# EAGLE schematic flip flop pcb 1.0 (EAGLE 6.5.0)
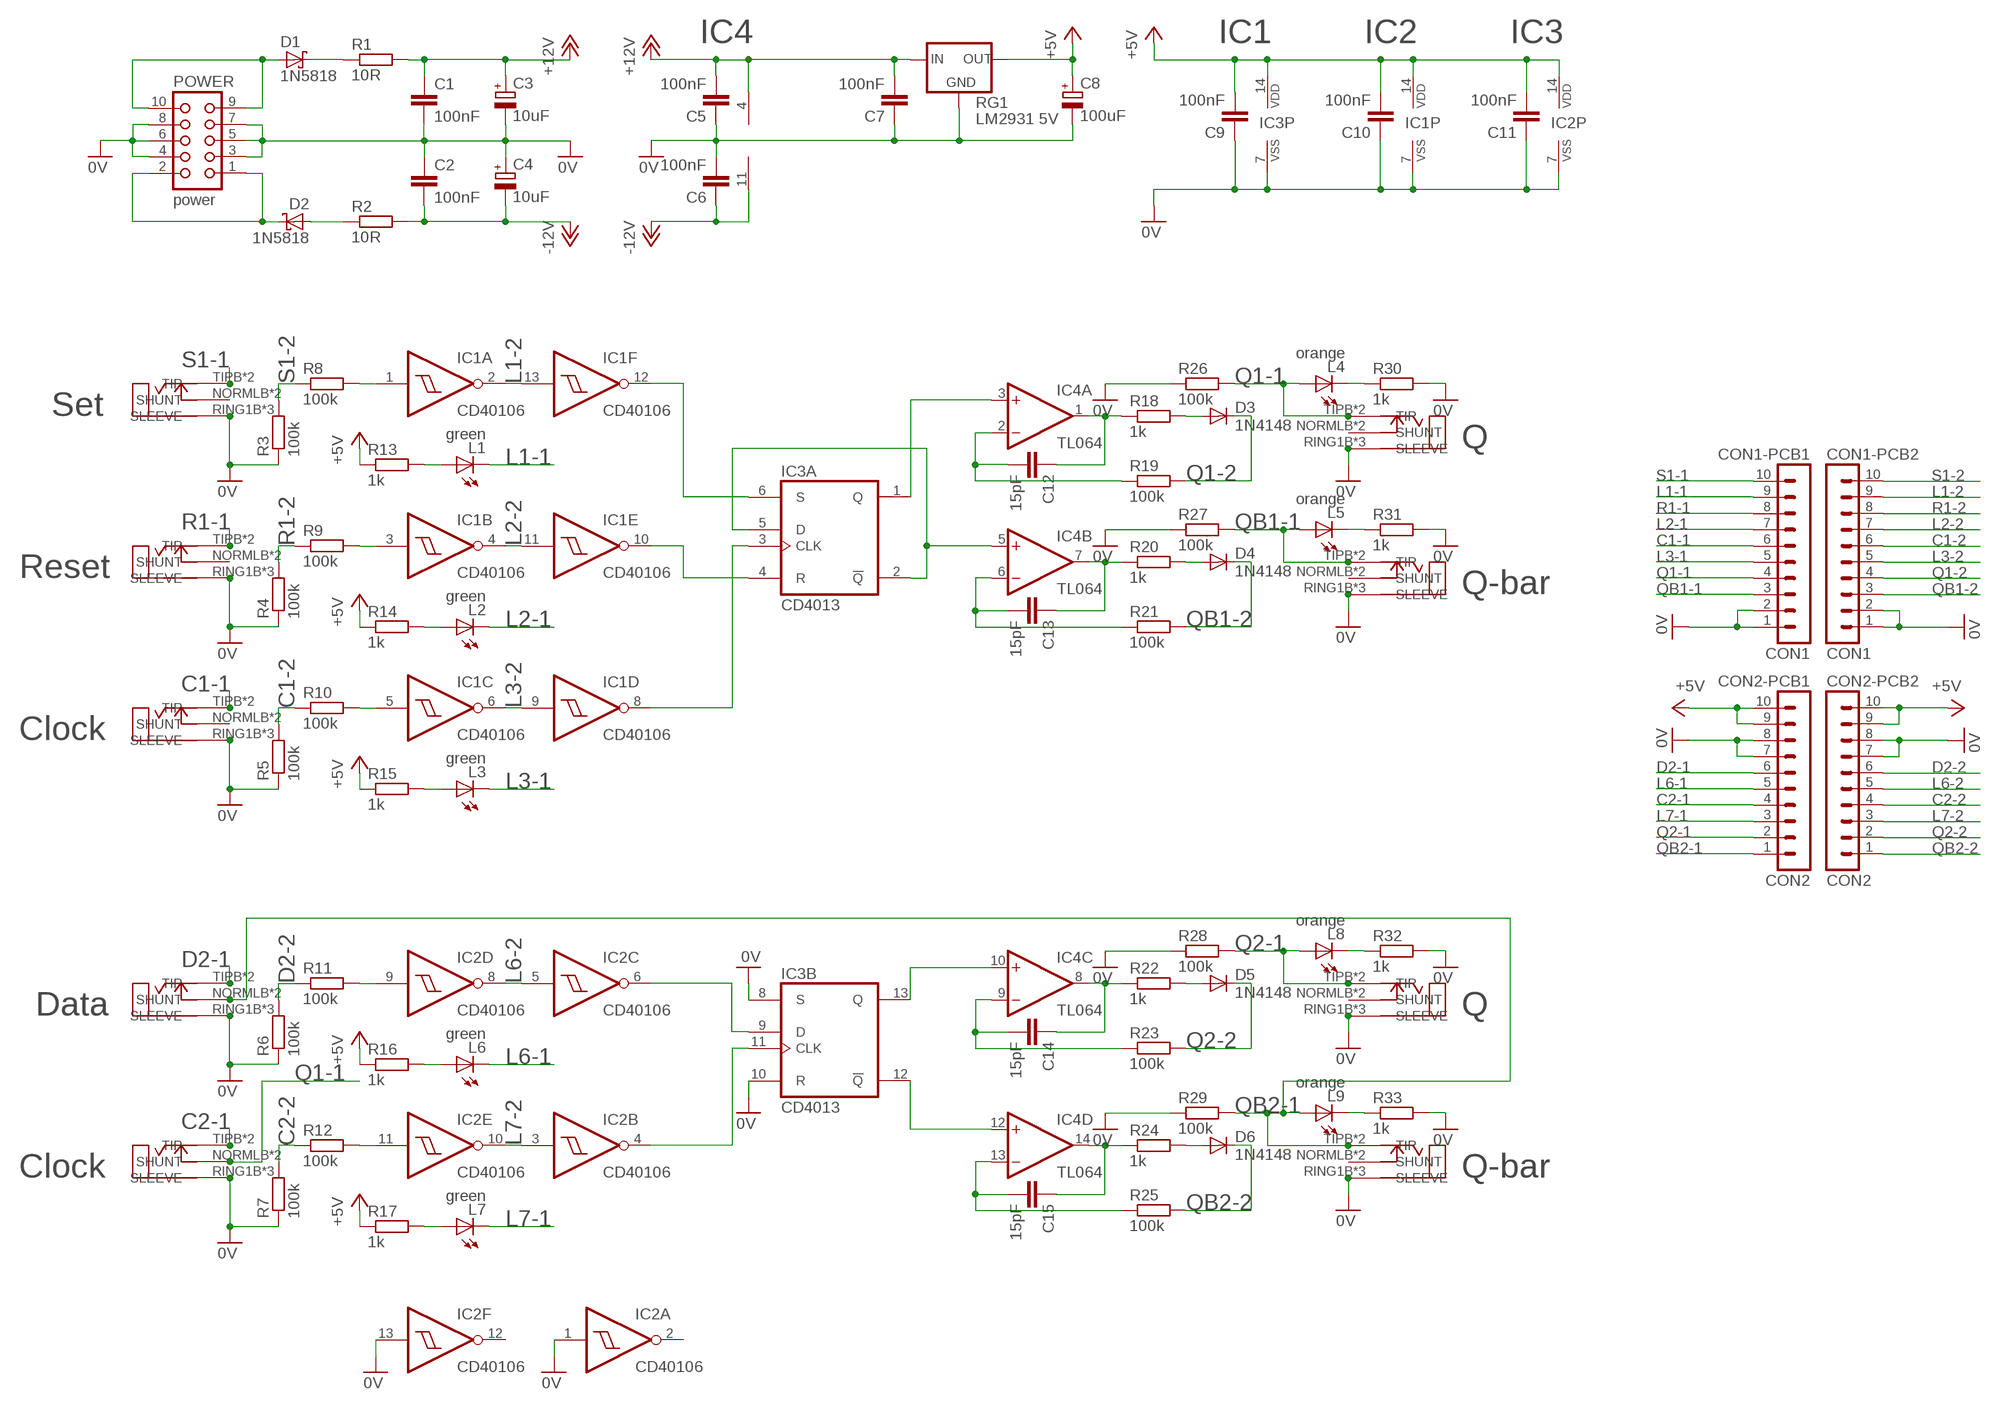
[diagram p0: schematic, sheet 1]

## Parts
C1  100nF  C-EU025-024X044  [C025-024X044]
C2  100nF  C-EU025-024X044  [C025-024X044]
C3  10uF  CPOL-EUE2-5  [E2-5]
C4  10uF  CPOL-EUE2-5  [E2-5]
C5  100nF  C-EU025-024X044  [C025-024X044]
C6  100nF  C-EU025-024X044  [C025-024X044]
C7  100nF  C-EU025-024X044  [C025-024X044]
C8  100uF  CPOL-EUE2.5-6  [E2,5-6]
C9  100nF  C-EU025-024X044  [C025-024X044]
C10  100nF  C-EU025-024X044  [C025-024X044]
C11  100nF  C-EU025-024X044  [C025-024X044]
C12  15pF  C-EU025-024X044  [C025-024X044]
C13  15pF  C-EU025-024X044  [C025-024X044]
C14  15pF  C-EU025-024X044  [C025-024X044]
C15  15pF  C-EU025-024X044  [C025-024X044]
CON1-PCB1  CON1  MA10-1  [MA10-1]
CON1-PCB2  CON1  MA10-1  [MA10-1]
CON2-PCB1  CON2  MA10-1  [MA10-1]
CON2-PCB2  CON2  MA10-1  [MA10-1]
D1  1N5818  SB130DO-204AL  [DO41-7]
D2  1N5818  SB130DO-204AL  [DO41-7]
D3  1N4148  1N4148DO35-7  [DO35-7]
D4  1N4148  1N4148DO35-7  [DO35-7]
D5  1N4148  1N4148DO35-7  [DO35-7]
D6  1N4148  1N4148DO35-7  [DO35-7]
IC1  CD40106  40106N  [DIL14]
IC2  CD40106  40106N  [DIL14]
IC3  CD4013  4013N  [DIL14]
IC4  TL064  TL074P  [DIL14]
J1  ERTHENVAR_3.5MM_JACKSLOTS  [ERTHENVAR-SLOTS]
J2  ERTHENVAR_3.5MM_JACKSLOTS  [ERTHENVAR-SLOTS]
J3  ERTHENVAR_3.5MM_JACKSLOTS  [ERTHENVAR-SLOTS]
J4  ERTHENVAR_3.5MM_JACKSLOTS  [ERTHENVAR-SLOTS]
J5  ERTHENVAR_3.5MM_JACKSLOTS  [ERTHENVAR-SLOTS]
J6  ERTHENVAR_3.5MM_JACKSLOTS  [ERTHENVAR-SLOTS]
J7  ERTHENVAR_3.5MM_JACKSLOTS  [ERTHENVAR-SLOTS]
J8  ERTHENVAR_3.5MM_JACKSLOTS  [ERTHENVAR-SLOTS]
J9  ERTHENVAR_3.5MM_JACKSLOTS  [ERTHENVAR-SLOTS]
L1  green  LED3MM  [LED3MM]
L2  green  LED3MM  [LED3MM]
L3  green  LED3MM  [LED3MM]
L4  orange  LED3MM  [LED3MM]
L5  orange  LED3MM  [LED3MM]
L6  green  LED3MM  [LED3MM]
L7  green  LED3MM  [LED3MM]
L8  orange  LED3MM  [LED3MM]
L9  orange  LED3MM  [LED3MM]
POWER  power  CON10L  [CON10L]
R1  10R  R-EU_0207/10  [0207/9]
R2  10R  R-EU_0207/10  [0207/9]
R3  100k  R-EU_0207/10  [0207/9]
R4  100k  R-EU_0207/10  [0207/9]
R5  100k  R-EU_0207/10  [0207/9]
R6  100k  R-EU_0207/10  [0207/9]
R7  100k  R-EU_0207/10  [0207/9]
R8  100k  R-EU_0207/10  [0207/9]
R9  100k  R-EU_0207/10  [0207/9]
R10  100k  R-EU_0207/10  [0207/9]
R11  100k  R-EU_0207/10  [0207/9]
R12  100k  R-EU_0207/10  [0207/9]
R13  1k  R-EU_0204/5  [0204/5]
R14  1k  R-EU_0204/5  [0204/5]
R15  1k  R-EU_0204/5  [0204/5]
R16  1k  R-EU_0204/5  [0204/5]
R17  1k  R-EU_0204/5  [0204/5]
R18  1k  R-EU_0207/10  [0207/9]
R19  100k  R-EU_0207/10  [0207/9]
R20  1k  R-EU_0207/10  [0207/9]
R21  100k  R-EU_0207/10  [0207/9]
R22  1k  R-EU_0207/10  [0207/9]
R23  100k  R-EU_0207/10  [0207/9]
R24  1k  R-EU_0207/10  [0207/9]
R25  100k  R-EU_0207/10  [0207/9]
R26  100k  R-EU_0204/5  [0204/5]
R27  100k  R-EU_0204/5  [0204/5]
R28  100k  R-EU_0204/5  [0204/5]
R29  100k  R-EU_0204/5  [0204/5]
R30  1k  R-EU_0204/5  [0204/5]
R31  1k  R-EU_0204/5  [0204/5]
R32  1k  R-EU_0204/5  [0204/5]
R33  1k  R-EU_0204/5  [0204/5]
RG1  LM2931 5V  78LXXLM2931XXX  [TO92-LINE]

## Nets
0V: C1.2 C2.1 C3.- C4.+ C5.1 C6.2 C7.1 C8.- C9.1 C10.1 C11.1 CON1-PCB1.1 CON1-PCB1.2 CON1-PCB2.1 CON1-PCB2.2 CON2-PCB1.7 CON2-PCB1.8 CON2-PCB2.7 CON2-PCB2.8 IC1.7(P:VSS) IC2.1(A:I) IC2.7(P:VSS) IC2.13(F:I) IC3.7(P:VSS) IC3.8(B:S) IC3.10(B:R) J1.RING1B(SLEEVE) J1.RING1T(SLEEVE) J1.RING2H(SLEEVE) J2.RING1B(SLEEVE) J2.RING1T(SLEEVE) J2.RING2H(SLEEVE) J3.RING1B(SLEEVE) J3.RING1T(SLEEVE) J3.RING2H(SLEEVE) J4.RING1B(SLEEVE) J4.RING1T(SLEEVE) J4.RING2H(SLEEVE) J5.RING1B(SLEEVE) J5.RING1T(SLEEVE) J5.RING2H(SLEEVE) J6.RING1B(SLEEVE) J6.RING1T(SLEEVE) J6.RING2H(SLEEVE) J7.RING1B(SLEEVE) J7.RING1T(SLEEVE) J7.RING2H(SLEEVE) J8.RING1B(SLEEVE) J8.RING1T(SLEEVE) J8.RING2H(SLEEVE) J9.RING1B(SLEEVE) J9.RING1T(SLEEVE) J9.RING2H(SLEEVE) POWER.3 POWER.4 POWER.5 POWER.6 POWER.7 POWER.8 R3.1 R4.1 R5.1 R6.1 R7.1 R26.1 R27.1 R28.1 R29.1 R30.2 R31.2 R32.2 R33.2 RG1.2(GND)
+5V: C8.+ C9.2 C10.2 C11.2 CON2-PCB1.9 CON2-PCB1.10 CON2-PCB2.9 CON2-PCB2.10 IC1.14(P:VDD) IC2.14(P:VDD) IC3.14(P:VDD) R13.1 R14.1 R15.1 R16.1 R17.1 RG1.3(OUT)
+12V: C1.1 C3.+ C5.2 C7.2 IC4.4(P:V+) R1.2 RG1.1(IN)
-12V: C2.2 C4.- C6.1 IC4.11(P:V-) R2.2
C1-1: CON1-PCB1.6 J3.TIPB(TIP) J3.TIPT(TIP)
C1-2: CON1-PCB2.6 R5.2 R10.1
C2-1: CON2-PCB1.4 J5.TIPB(TIP) J5.TIPT(TIP)
C2-2: CON2-PCB2.4 R7.2 R12.1
D2-1: CON2-PCB1.6 J4.TIPB(TIP) J4.TIPT(TIP)
D2-2: CON2-PCB2.6 R6.2 R11.1
L1-1: CON1-PCB1.9 L1.K(C)
L1-2: CON1-PCB2.9 IC1.2(A:O) IC1.13(F:I)
L2-1: CON1-PCB1.7 L2.K(C)
L2-2: CON1-PCB2.7 IC1.4(B:O) IC1.11(E:I)
L3-1: CON1-PCB1.5 L3.K(C)
L3-2: CON1-PCB2.5 IC1.6(C:O) IC1.9(D:I)
L6-1: CON2-PCB1.5 L6.K(C)
L6-2: CON2-PCB2.5 IC2.5(C:I) IC2.8(D:O)
L7-1: CON2-PCB1.3 L7.K(C)
L7-2: CON2-PCB2.3 IC2.3(B:I) IC2.10(E:O)
N$2: IC1.1(A:I) R8.2
N$3: IC3.2(A:!Q) IC3.5(A:D) IC4.5(B:+IN)
N$4: IC1.3(B:I) R9.2
N$5: IC1.5(C:I) R10.2
N$6: IC2.9(D:I) R11.2
N$8: IC2.11(E:I) R12.2
N$16: IC1.12(F:O) IC3.6(A:S)
N$17: IC1.10(E:O) IC3.4(A:R)
N$18: IC1.8(D:O) IC3.3(A:CLK)
N$19: IC2.4(B:O) IC3.11(B:CLK)
N$21: IC2.6(C:O) IC3.9(B:D)
N$22: IC3.1(A:Q) IC4.3(A:+IN)
N$23: C12.2 IC4.2(A:-IN) R19.1
N$24: C12.1 IC4.1(A:OUT) R18.1
N$25: D3.A R18.2
N$27: C13.2 IC4.6(B:-IN) R21.1
N$28: C13.1 IC4.7(B:OUT) R20.1
N$29: D4.A R20.2
N$31: IC3.13(B:Q) IC4.10(C:+IN)
N$32: IC3.12(B:!Q) IC4.12(D:+IN)
N$33: C15.2 IC4.13(D:-IN) R25.1
N$34: C15.1 IC4.14(D:OUT) R24.1
N$35: D6.A R24.2
N$36: D1.C R1.1
N$38: C14.2 IC4.9(C:-IN) R23.1
N$39: C14.1 IC4.8(C:OUT) R22.1
N$40: D5.A R22.2
N$42: D1.A POWER.9 POWER.10
N$43: D2.C POWER.1 POWER.2
N$44: D2.A R2.1
N$45: L1.A R13.2
N$46: L2.A R14.2
N$47: L3.A R15.2
N$48: L4.K(C) R30.1
N$49: L5.K(C) R31.1
N$51: L6.A R16.2
N$52: L7.A R17.2
N$53: L8.K(C) R32.1
N$54: L9.K(C) R33.1
Q1-1: CON1-PCB1.4 J5.NORMLB(SHUNT) J5.NORMLT(SHUNT) J6.TIPB(TIP) J6.TIPT(TIP) L4.A R26.2
Q1-2: CON1-PCB2.4 D3.C R19.2
Q2-1: CON2-PCB1.2 J8.TIPB(TIP) J8.TIPT(TIP) L8.A R28.2
Q2-2: CON2-PCB2.2 D5.C R23.2
QB1-1: CON1-PCB1.3 J7.TIPB(TIP) J7.TIPT(TIP) L5.A R27.2
QB1-2: CON1-PCB2.3 D4.C R21.2
QB2-1: CON2-PCB1.1 J4.NORMLB(SHUNT) J4.NORMLT(SHUNT) J9.TIPB(TIP) J9.TIPT(TIP) L9.A R29.2
QB2-2: CON2-PCB2.1 D6.C R25.2
R1-1: CON1-PCB1.8 J2.TIPB(TIP) J2.TIPT(TIP)
R1-2: CON1-PCB2.8 R4.2 R9.1
S1-1: CON1-PCB1.10 J1.TIPB(TIP) J1.TIPT(TIP)
S1-2: CON1-PCB2.10 R3.2 R8.1
Unconnected: IC2.2(A:O) IC2.12(F:O) J1.NORMLB(SHUNT) J1.NORMLT(SHUNT) J2.NORMLB(SHUNT) J2.NORMLT(SHUNT) J3.NORMLB(SHUNT) J3.NORMLT(SHUNT) J6.NORMLB(SHUNT) J6.NORMLT(SHUNT) J7.NORMLB(SHUNT) J7.NORMLT(SHUNT) J8.NORMLB(SHUNT) J8.NORMLT(SHUNT) J9.NORMLB(SHUNT) J9.NORMLT(SHUNT)

## Notes on the sheet
- IC4 | IC1 | IC2 | IC3
- Set
- Q
- Reset
- Q-bar
- Clock
- Data | Q
- Clock | Q-bar

## Library data of the parts
C1 C2 C5-C7 C9-C15 = Roll Your Own:C-EU: CAPACITOR, European symbol
C3 C4 C8 = Roll Your Own:CPOL-EU: POLARIZED CAPACITOR, European symbol
CON1-PCB1 CON1-PCB2 CON2-PCB1 CON2-PCB2 = Roll Your Own:MA10-1: PIN HEADER; OC_FARNELL: unknown; OC_NEWARK: unknown
D1 D2 = Roll Your Own:SB130
D3-D6 = Roll Your Own:1N4148: DIODE high speed (Philips)
IC1 IC2 = Roll Your Own:40106: Hex SCHMITT TRIGGER
IC3 = Roll Your Own:4013: Dual D FLIP FLOP, set/reset
IC4 = Roll Your Own:TL074: OP AMP
J1-J9 = Roll Your Own:ERTHENVAR_3.5MM_JACK
L1-L9 = Roll Your Own:LED: LED OSRAM: - CHIPLED LG R971, LG N971, LY N971, LG Q971, LY Q971, LO R971, LY R971 LH N974, LH R974 LS Q976, LO Q976, LY Q976 LO Q996 - Hyper CHIPLED LW Q18S LB Q993, LB Q99A, LB R99A - SideLED LS A670, LO A670, LY A670, LG A670, LP A670 LB A673, LV A673, LT A673, LW A673 LH A674 LY A675 LS A676, LA A676, LO A676, LY A676, LW A676 LS A679, LY A679, LG A679 - Hyper Micro SIDELED® LS Y876, LA Y876, LO Y876, LY Y876 LT Y87S - SmartLED LW L88C, LW L88S LB L89C, LB L89S, LG L890 LS L89K, LO L89K, LY L89K LS L896, LA L896, LO L896, LY L896 - TOPLED LS T670, LO T670, LY T670, LG T670, LP T670 LSG T670, LSP T670, LSY T670, LOP T670, LYG T670 LG T671, LOG T671, LSG T671 LB T673, LV T673, LT T673, LW T673 LH T674 LS T676, LA T676, LO T676, LY T676, LB T676, LH T676, LSB T676, LW T676 LB T67C, LV T67C, LT T67C, LS T67K, LO T67K, LY T67K, LW E67C LS E67B, LA E67B, LO E67B, LY E67B, LB E67C, LV E67C, LT E67C LW T67C LS T679, LY T679, LG T679 LS T770, LO T770, LY T770, LG T770, LP T770 LB T773, LV T773, LT T773, LW T773 LH T774 LS E675, LA E675, LY E675, LS T675 LS T776, LA T776, LO T776, LY T776, LB T776 LHGB T686 LT T68C, LB T68C - Hyper Mini TOPLED® LB M676 - Mini TOPLED Santana® LG M470 LS M47K, LO M47K, LY M47K Source: http://www.osram.convergy.de LUXEON: - LUMILED® LXK2-PW12-R00, LXK2-PW12-S00, LXK2-PW14-U00, LXK2-PW14-V00 LXK2-PM12-R00, LXK2-PM12-S00, LXK2-PM14-U00 LXK2-PE12-Q00, LXK2-PE12-R00, LXK2-PE12-S00, LXK2-PE14-T00, LXK2-PE14-U00 LXK2-PB12-K00, LXK2-PB12-L00, LXK2-PB12-M00, LXK2-PB14-N00, LXK2-PB14-P00, LXK2-PB14-Q00 LXK2-PR12-L00, LXK2-PR12-M00, LXK2-PR14-Q00, LXK2-PR14-R00 LXK2-PD12-Q00, LXK2-PD12-R00, LXK2-PD12-S00 LXK2-PH12-R00, LXK2-PH12-S00 LXK2-PL12-P00, LXK2-PL12-Q00, LXK2-PL12-R00 Source: www.luxeon.com KINGBRIGHT: KA-3528ASYC Source: www.kingbright.com
POWER = Roll Your Own:CON10L: CONNECTOR; OC_FARNELL: unknown; OC_NEWARK: unknown
R1-R33 = Roll Your Own:R-EU_: RESISTOR, European symbol
RG1 = Roll Your Own:78LXX: VOLTAGE REGULATOR